# EAGLE design Szymon.Sochaj_schemat1 (EAGLE 9.6.0)
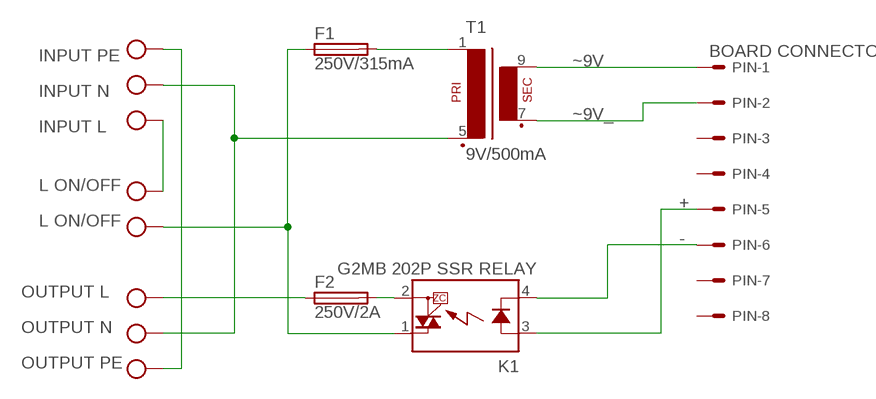
[diagram p0: schematic, sheet 1]

## Parts
F1  250V/315mA  SMIWPROJEKT_FUSEBLANK_5X20MM  [SMIWPROJEKT_FUSE_HOLDER_5X20MM]
F2  250V/2A  SMIWPROJEKT_FUSEBLANK_5X20MM  [SMIWPROJEKT_FUSE_HOLDER_5X20MM]
K1  G2MB 202P SSR RELAY  SMIWPROJEKT_OMRON-G3MB-202P-SSR  [SMIWPROJEKT_OMRON-G3MB-202P-SSR]
PIN  BOARD CONNECTOR  CON-MOLEX_22-05-7088-08  [CON-MOLEX_7395-08]
T1  9V/500mA  SMIWPROJEKT_VR11  [SMIWPROJEKT_VR11]
X1  CON-PTR500_AK300/3  [CON-PTR500_AK300/3]
X2  CON-PTR500_AK300/3  [CON-PTR500_AK300/3]
X3  CON-PTR500_AK300/2  [CON-PTR500_AK300/2]

## Nets
+: K1.3(A) PIN.5
-: K1.4(K) PIN.6
L: F1.1 K1.1(DS1) X3.2
L_IN: X1.1 X3.1
L_OUT: F2.1 X2.1
N: T1.5(P2) X1.2 X2.2
N$1: F2.2 K1.2(DS2)
N$8: F1.2 T1.1
PE: X1.3 X2.3
~9V: PIN.1 T1.9(S4)
~9V_: PIN.2 T1.7(S3)
Unconnected: PIN.3 PIN.4 PIN.7 PIN.8

## Library data of the parts
F1 F2 = Szymon.Sochaj_schemat1:SMIWPROJEKT_FUSE: Fuse; OC_FARNELL: unknown; OC_NEWARK: unknown
K1 = Szymon.Sochaj_schemat1:SMIWPROJEKT_OMRON-G3MB-202P-SSR: IT(rms) 8A, Zero Cross type SIP 4pin Triac output SSR Source: http://sharp-world.com/products/device/lineup/data/pdf/datasheet/s102s02_e.pdf
PIN = Szymon.Sochaj_schemat1:CON-MOLEX_22-?-08: CONNECTOR wire to board 2.54 mm (.1 inch) pitch header; MF: MOLEX; OC_FARNELL: unknown; OC_NEWARK: unknown
T1 = Szymon.Sochaj_schemat1:SMIWPROJEKT_VR11: TRANSFORMER 1 primary winding, 1 secondary winding BLOCK
X1 = Szymon.Sochaj_schemat1:CON-PTR500_AK300/3: CONNECTOR; L: INPUT L; N: INPUT N; OC_FARNELL: unknown; OC_NEWARK: unknown; PE: INPUT PE
X2 = Szymon.Sochaj_schemat1:CON-PTR500_AK300/3: CONNECTOR; L: OUTPUT L; N: OUTPUT N; OC_FARNELL: unknown; OC_NEWARK: unknown; PE: OUTPUT PE
X3 = Szymon.Sochaj_schemat1:CON-PTR500_AK300/2: CONNECTOR; L: L ON/OFF; OC_FARNELL: unknown; OC_NEWARK: unknown

## Net classes
0 default: width 0.356 mm

## Board
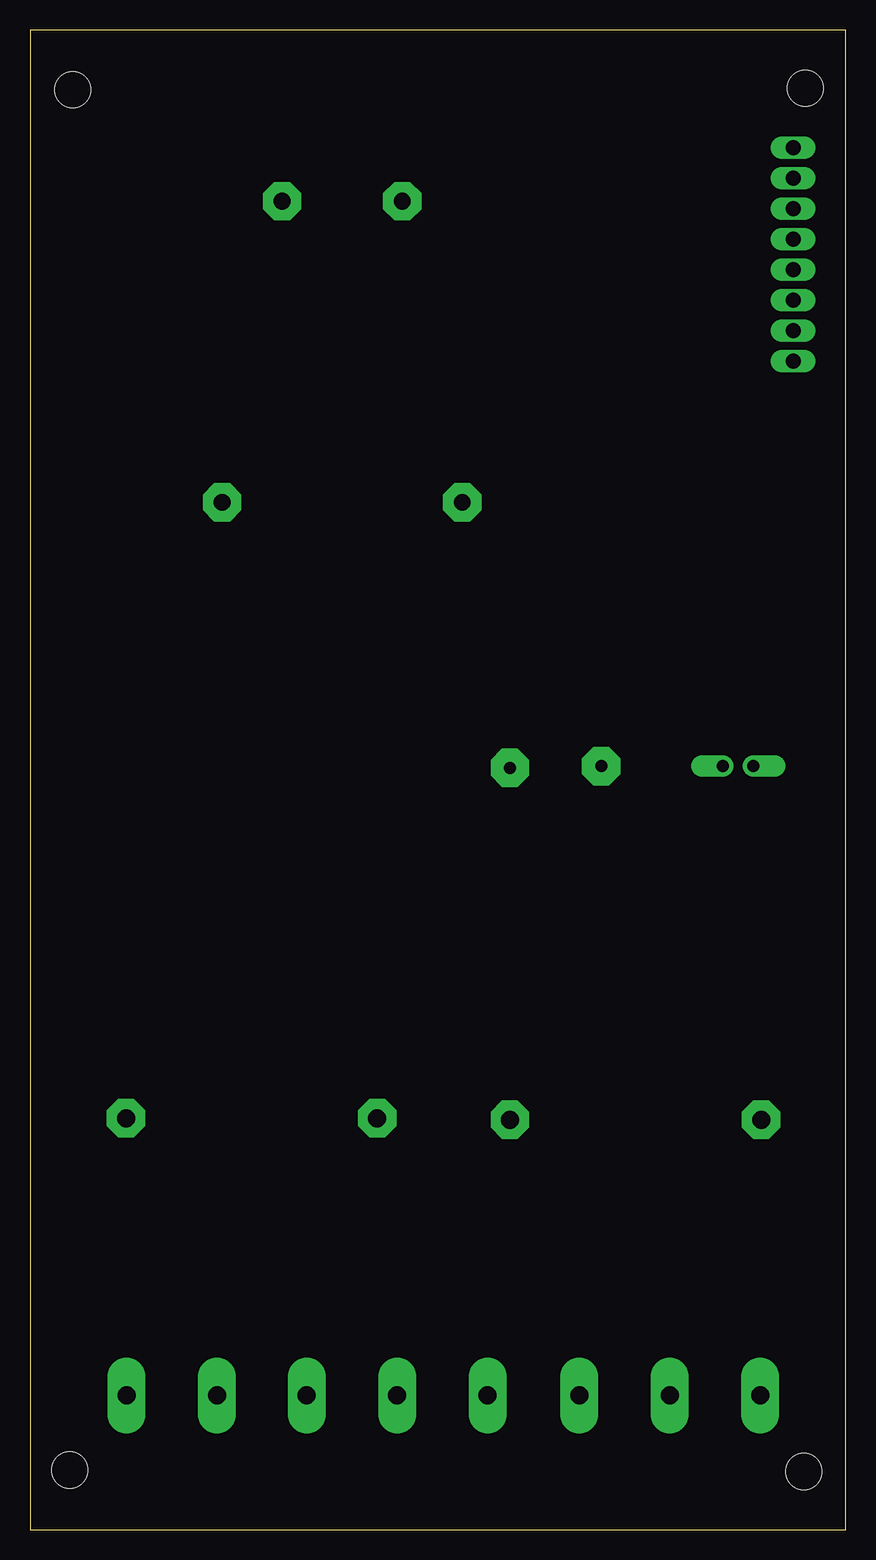
[diagram p1: board, top side]
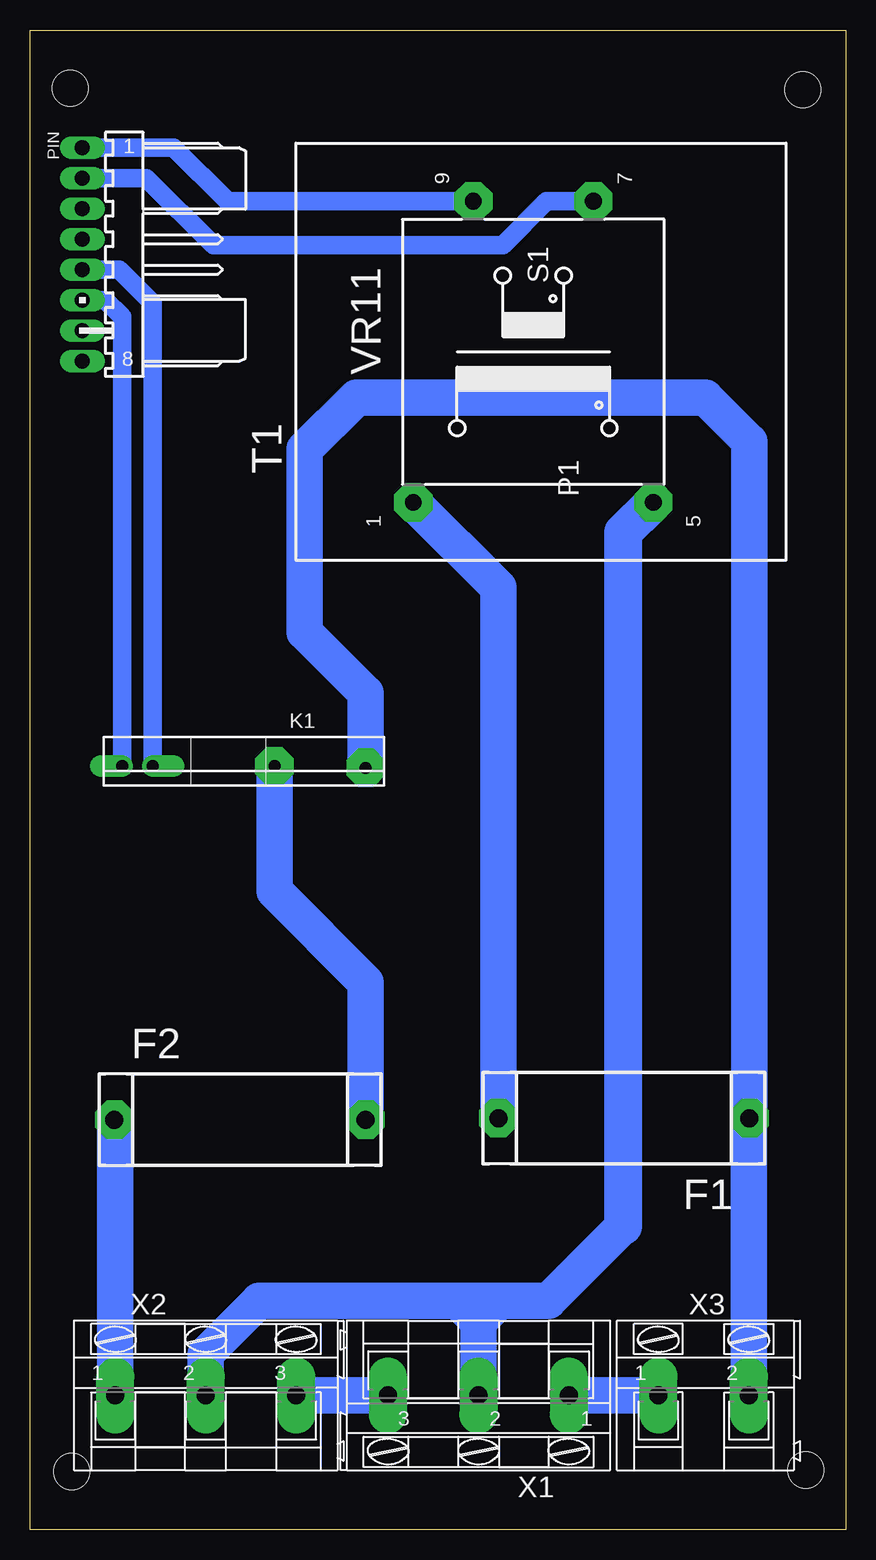
[diagram p2: board, bottom side, seen from below]

Size 68 x 125 mm. Coordinates in mm from the lower left corner, seen from the top.
Outline: 68,0 68,125 0,125 0,0 68,0
Copper layers (1*16): Top 0.035mm / dielectric 1.5mm / Bottom 0.035mm
Design rules "default *": minimum track width 20mil, minimum drill 0.5mm, track to track 6mil, track to pad 6mil, pad to pad 6mil, via to via 6mil, smd to smd 6mil, copper to edge 40mil, drill to drill 6mil, minimum pad ring 10mil, minimum via ring 8mil, stop-mask expansion 4mil, vias tented up to drill 0mil, thermal gap 10mil
Holes 3 mm at 64.64,120.14 3.3,4.95 64.52,4.83 3.56,120.02

### Footprints (pad centres in the part's own frame; a part is rotated, then mirrored left to right if it is on the bottom)
SMIWPROJEKT_FUSE_HOLDER_5X20MM = drill 1.5 pad 3.175 octagon: 1 -5.715,0; 2 15.24,0
SMIWPROJEKT_OMRON-G3MB-202P-SSR = drill 1 pad 3.175 octagon: 1 -13.081,0.127; 2 -5.461,0 | drill 1 pad 1.778 offset: 3 4.699,0; 4 7.239,0
CON-MOLEX_7395-08 = drill 1.25 pad 1.778 long: 1 8.89,0; 2 6.35,0; 3 3.81,0; 4 1.27,0; 5 -1.27,0; 6 -3.81,0; 7 -6.35,0; 8 -8.89,0
SMIWPROJEKT_VR11 = drill 1.397 pad 3.175 octagon: 1 -13.818,6.198; 5 -13.818,-13.818; 7 11.278,-8.814; 9 11.278,1.194
CON-PTR500_AK300/3 = drill 1.5 pad 3.175 long: 1 -7.544,0; 2 0,0; 3 7.544,0
CON-PTR500_AK300/2 = drill 1.5 pad 3.175 long: 1 -7.595,0; 2 -0.051,0

### Placement (x,y rotation side)
F1  13.72,34.29 180 bottom
F2  55.24,34.16 0 bottom
K1  53.09,63.63 180 bottom
PIN  63.63,106.3 90 bottom
T1  29.84,99.44 90 bottom
X1  30.61,11.18 180 bottom
X2  53.34,11.18 0 bottom
X3  8,11.18 0 bottom

### Tracks (layer width: path | path; a pad name or v marks a point on that pad's centre or on a via)
+
  Bottom 1.524: PIN.5 60.58,105.03 57.78,102.23 K1.3
-
  Bottom 1.524: PIN.6 61.72,102.49 60.33,101.09 K1.4
L
  Bottom 3.048: X3.2 8.05,34.27 F1.1 8,90.68 11.68,94.36 40.77,94.36 45.09,90.04 45.09,74.8 40.01,69.72 K1.1
L_IN
  Bottom 3.048: X3.1 X1.1
L_OUT
  Bottom 3.048: X2.1 60.88,34.09 F2.1
N
  Bottom 3.048: X2.2 53.34,14.61 48.9,19.05 32.38,19.05 | 32.38,19.05 30.61,17.27 | 32.38,19.05 28.83,19.05 | 28.83,19.05 24.77,19.05 18.54,25.27 | 28.83,19.05 30.61,17.27 | 30.61,17.27 X1.2
  Bottom 3.175: T1.5 18.54,83.11 18.54,25.27
N$1
  Bottom 3.048: F2.2 40.01,45.59 47.62,53.21 K1.2
N$8
  Bottom 3.048: F1.2 28.96,78.54 T1.1
PE
  Bottom 3.048: X1.3 X2.3
~9V
  Bottom 1.524: T1.9 51.54,110.72 56.01,115.19 PIN.1
~9V_
  Bottom 1.524: T1.7 24.92,110.72 28.57,107.06 52.7,107.06 58.29,112.65 PIN.2